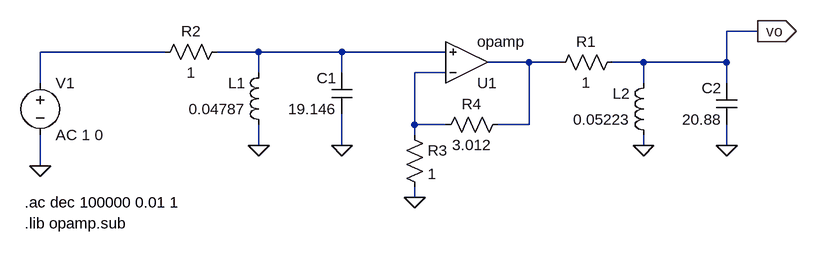
[diagram p0: schematic 20240513_Ejercicio1_v2.asc]
20240513_Ejercicio1_v2.asc, the LTspice schematic file:
Version 4
SHEET 1 1448 680
WIRE 1072 96 1024 96
WIRE 160 128 -32 128
WIRE 304 128 240 128
WIRE 432 128 304 128
WIRE 592 128 432 128
WIRE 720 144 656 144
WIRE 768 144 720 144
WIRE 896 144 848 144
WIRE 1024 144 1024 96
WIRE 1024 144 896 144
WIRE 304 160 304 128
WIRE 432 160 432 128
WIRE 592 160 544 160
WIRE -32 176 -32 128
WIRE 896 176 896 144
WIRE 1024 176 1024 144
WIRE 544 240 544 160
WIRE 592 240 544 240
WIRE 720 240 720 144
WIRE 720 240 672 240
WIRE 544 256 544 240
WIRE 304 272 304 240
WIRE 432 272 432 224
WIRE 896 272 896 256
WIRE 1024 272 1024 240
WIRE -32 304 -32 256
WIRE 544 352 544 336
FLAG 1072 96 vo
IOPIN 1072 96 Out
FLAG -32 304 0
FLAG 304 272 0
FLAG 1024 272 0
FLAG 544 352 0
FLAG 432 272 0
FLAG 896 272 0
SYMBOL cap 448 224 R180
WINDOW 0 24 56 Left 2
WINDOW 3 24 8 Left 2
SYMATTR InstName C1
SYMATTR Value 19.146
SYMBOL ind 320 256 R180
WINDOW 0 36 80 Left 2
WINDOW 3 36 40 Left 2
SYMATTR InstName L1
SYMATTR Value 0.04787
SYMATTR SpiceLine Rser=0
SYMBOL voltage -32 160 R0
SYMATTR InstName V1
SYMATTR Value AC 1 0
SYMBOL res 256 112 R90
WINDOW 0 0 56 VBottom 2
WINDOW 3 32 56 VTop 2
SYMATTR InstName R2
SYMATTR Value 1
SYMBOL cap 1040 240 R180
WINDOW 0 24 56 Left 2
WINDOW 3 24 8 Left 2
SYMATTR InstName C2
SYMATTR Value 20.88
SYMBOL ind 912 272 R180
WINDOW 0 36 80 Left 2
WINDOW 3 36 40 Left 2
SYMATTR InstName L2
SYMATTR Value 0.05223
SYMATTR SpiceLine Rser=0
SYMBOL res 864 128 R90
WINDOW 0 0 56 VBottom 2
WINDOW 3 32 56 VTop 2
SYMATTR InstName R1
SYMATTR Value 1
SYMBOL OpAmps\\opamp 624 208 M180
SYMATTR InstName U1
SYMBOL res 528 240 R0
SYMATTR InstName R3
SYMATTR Value 1
SYMBOL res 688 224 R90
WINDOW 0 0 56 VBottom 2
WINDOW 3 32 56 VTop 2
SYMATTR InstName R4
SYMATTR Value 3.012
TEXT -56 360 Left 2 !.ac dec 100000 0.01 1
TEXT -56 392 Left 2 !.lib opamp.sub

The netlist it stands for:
* 20240513_Ejercicio1_v2.asc
C1 0 N002 19.146
L1 0 N002 0.04787 Rser=0
V1 N001 0 AC 1 0
R2 N002 N001 1
C2 0 vo 20.88
L2 0 vo 0.05223 Rser=0
R1 vo N003 1
XU1 N004 N002 N003 opamp Aol=100K GBW=10Meg  ; pins invin noninvin out
R3 N004 0 1
R4 N003 N004 3.012
.ac dec 100000 0.01 1
.lib opamp.sub
.backanno
.end